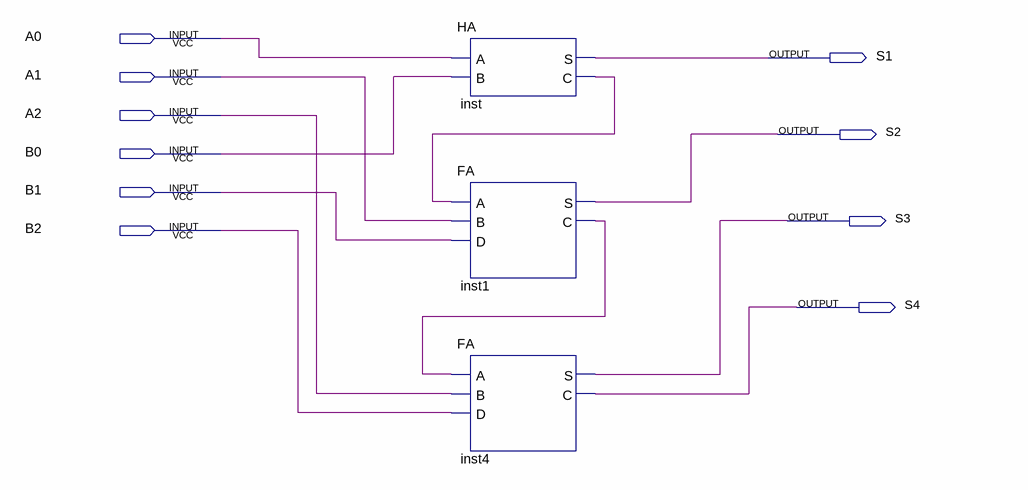
[diagram p0: schematic sheet]
// Quartus schematic Suma.bdf as structural Verilog: 3 symbols, 10 pins
module Suma (
  input  A0,
  input  A1,
  input  A2,
  input  B0,
  input  B1,
  input  B2,
  output S1,
  output S2,
  output S3,
  output S4
);

  wire inst1_c, inst_c;

  HA inst (.A(A0), .B(B0), .S(S1), .C(inst_c));
  FA inst1 (.A(inst_c), .B(A1), .D(B1), .S(S2), .C(inst1_c));
  FA inst4 (.A(inst1_c), .B(A2), .D(B2), .S(S3), .C(S4));
endmodule
